# EAGLE schematic DashDialV3 (EAGLE 9.6.2)
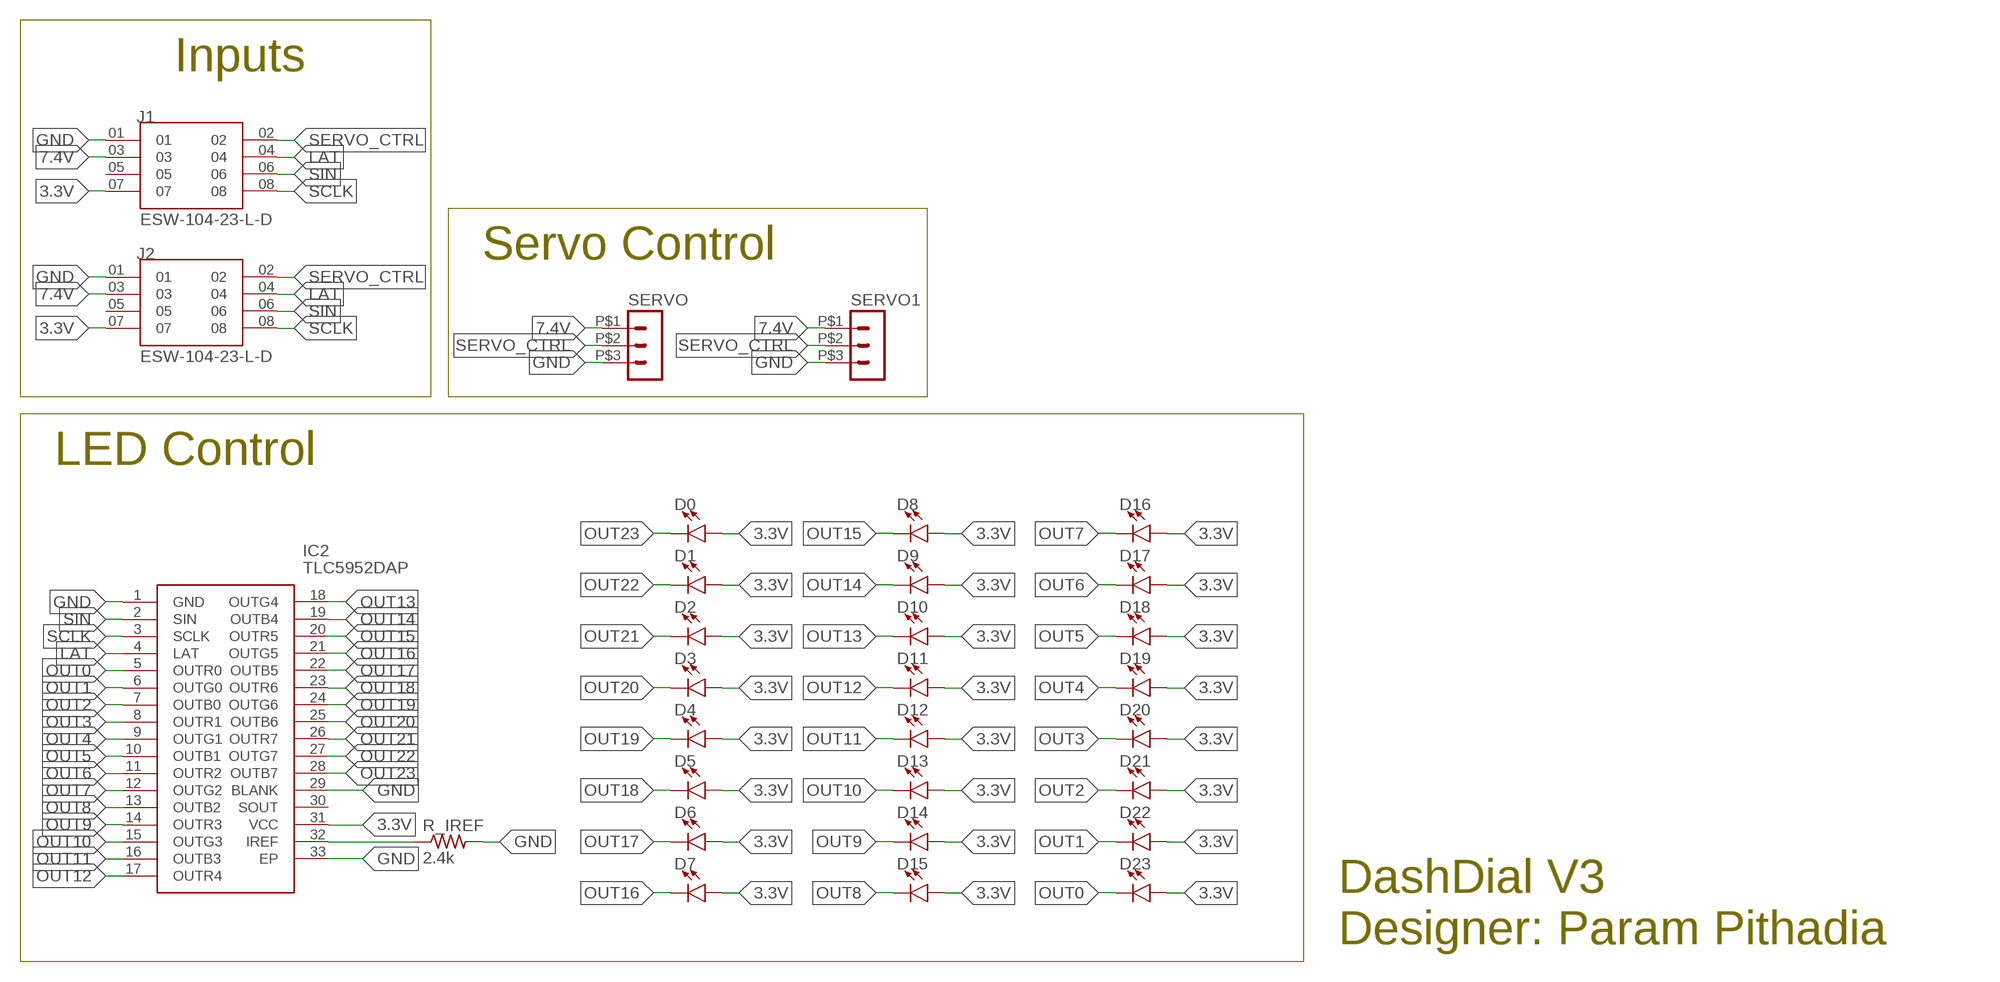
[diagram p0: schematic, sheet 1]

## Parts
D0  LED3MM  [LED_3MM]
D1  LED3MM  [LED_3MM]
D2  LED3MM  [LED_3MM]
D3  LED3MM  [LED_3MM]
D4  LED3MM  [LED_3MM]
D5  LED3MM  [LED_3MM]
D6  LED3MM  [LED_3MM]
D7  LED3MM  [LED_3MM]
D8  LED3MM  [LED_3MM]
D9  LED3MM  [LED_3MM]
D10  LED3MM  [LED_3MM]
D11  LED3MM  [LED_3MM]
D12  LED3MM  [LED_3MM]
D13  LED3MM  [LED_3MM]
D14  LED3MM  [LED_3MM]
D15  LED3MM  [LED_3MM]
D16  LED3MM  [LED_3MM]
D17  LED3MM  [LED_3MM]
D18  LED3MM  [LED_3MM]
D19  LED3MM  [LED_3MM]
D20  LED3MM  [LED_3MM]
D21  LED3MM  [LED_3MM]
D22  LED3MM  [LED_3MM]
D23  LED3MM  [LED_3MM]
IC2  TLC5952DAP  [SOP65P810X120-33N]
J1  ESW-104-23-L-D  [SAMTEC_ESW-104-23-L-D]
J2  ESW-104-23-L-D  [SAMTEC_ESW-104-23-L-D]
R_IREF  2.4k  RES_SMDR0603  [R0603]
SERVO  HEADER_POS3_43650-0300  [43650-0300]
SERVO1  HEADER_POS3_43650-0300  [43650-0300]

## Nets
3.3V: D0.A D1.A D2.A D3.A D4.A D5.A D6.A D7.A D8.A D9.A D10.A D11.A D12.A D13.A D14.A D15.A D16.A D17.A D18.A D19.A D20.A D21.A D22.A D23.A IC2.31(VCC) J1.07 J2.07
7.4V: J1.03 J2.03 SERVO1.P$1 SERVO.P$1
GND: IC2.1(GND) IC2.29(BLANK) IC2.33(EP) J1.01 J2.01 R_IREF.2 SERVO1.P$3 SERVO.P$3
LAT: IC2.4(LAT) J1.04 J2.04
N$31: IC2.32(IREF) R_IREF.1
OUT0: D23.K(C) IC2.5(OUTR0)
OUT1: D22.K(C) IC2.6(OUTG0)
OUT2: D21.K(C) IC2.7(OUTB0)
OUT3: D20.K(C) IC2.8(OUTR1)
OUT4: D19.K(C) IC2.9(OUTG1)
OUT5: D18.K(C) IC2.10(OUTB1)
OUT6: D17.K(C) IC2.11(OUTR2)
OUT7: D16.K(C) IC2.12(OUTG2)
OUT8: D15.K(C) IC2.13(OUTB2)
OUT9: D14.K(C) IC2.14(OUTR3)
OUT10: D13.K(C) IC2.15(OUTG3)
OUT11: D12.K(C) IC2.16(OUTB3)
OUT12: D11.K(C) IC2.17(OUTR4)
OUT13: D10.K(C) IC2.18(OUTG4)
OUT14: D9.K(C) IC2.19(OUTB4)
OUT15: D8.K(C) IC2.20(OUTR5)
OUT16: D7.K(C) IC2.21(OUTG5)
OUT17: D6.K(C) IC2.22(OUTB5)
OUT18: D5.K(C) IC2.23(OUTR6)
OUT19: D4.K(C) IC2.24(OUTG6)
OUT20: D3.K(C) IC2.25(OUTB6)
OUT21: D2.K(C) IC2.26(OUTR7)
OUT22: D1.K(C) IC2.27(OUTG7)
OUT23: D0.K(C) IC2.28(OUTB7)
SCLK: IC2.3(SCLK) J1.08 J2.08
SERVO_CTRL: J1.02 J2.02 SERVO1.P$2 SERVO.P$2
SIN: IC2.2(SIN) J1.06 J2.06
Unconnected: IC2.30(SOUT) J1.05 J2.05

## Notes on the sheet
- Inputs
- Servo Control
- LED Control
- DashDial V3
  Designer: Param Pithadia

## Library data of the parts
D0 D1-D23 = SparkFun-LED:LED: LED (Generic) Standard schematic elements and footprints for 5mm, 3mm, 1206, and 0603 sized LEDs. Generic LEDs with no color specified.; PROD_ID: DIO-08794
IC2 = GTOR - Active Components:TLC5952DAP: 24-Channel Constant-Current LED Driver with Global Brightness and LED Open Short Detection Source: Datasheet <http://www.ti.com/lit/gpn/tlc5952>; ARROW_PART_NUMBER: TLC5952DAP; ARROW_PRICE-STOCK: https://www.arrow.com/en/products/tlc5952dap/texas-instruments; DESCRIPTION: 24-Channel Constant-Current LED Driver with Global Brightness and LED Open Short Detection; HEIGHT: mm; MANUFACTURER_NAME: Texas Instruments; MANUFACTURER_PART_NUMBER: TLC5952DAP; MOUSER_PART_NUMBER: 595-TLC5952DAP; MOUSER_PRICE-STOCK: https://www.mouser.co.uk/ProductDetail/Texas-Instruments/TLC5952DAP?qs=IK5e5L0zOXhuADcxoTQ%252BEg%3D%3D
J1 J2 = ESW-104-23-L-D:ESW-104-23-L-D; MANUFACTURER: Samtec Inc.; PARTREV: R; STANDARD: Manufacturer Recommendations
R_IREF = GTOR - Passive Components:RES_SMD: RESISTOR, American symbol; SPICEPREFIX: R
SERVO SERVO1 = GTOR - Microfit Connector:HEADER_POS3_?: Molex - Micro-Fit 3.0 Series connector, 3.00mm (0.118") pitch header, 3 positions.